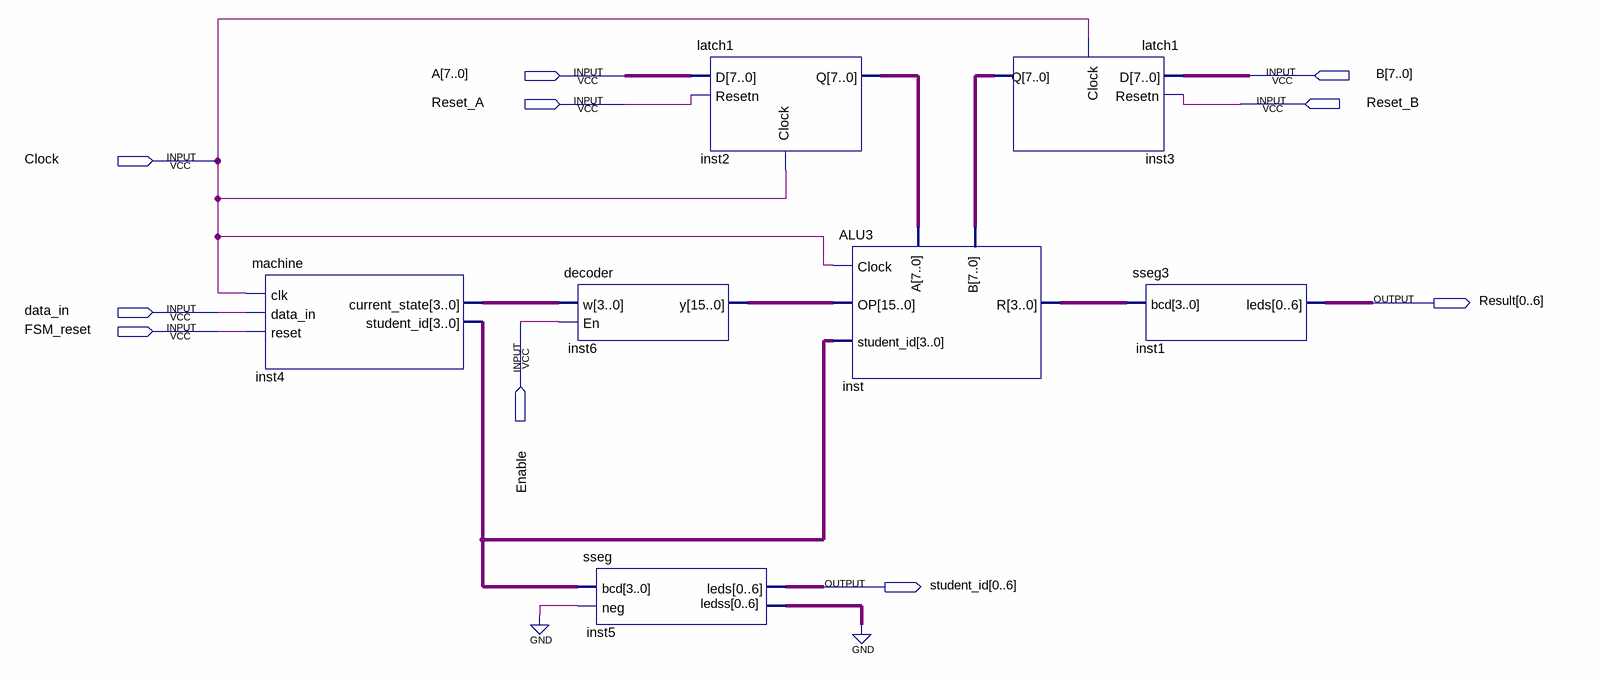
[diagram p0: schematic sheet]
// Quartus schematic problem3.bdf as structural Verilog: 7 symbols, 10 pins
module problem3 (
  input  [7:0] A,
  input  [7:0] B,
  input  Reset_A,
  input  Reset_B,
  input  Clock,
  input  data_in,
  input  Enable,
  input  FSM_reset,
  output [0:6] Result,
  output [0:6] student_id
);

  wire [3:0] inst4_current_state, inst4_student_id, inst_r;
  wire [6:0] inst5_ledss;
  wire [7:0] inst2_q, inst3_q;
  wire [15:0] inst6_y;

  machine inst4 (
    .clk(Clock), .data_in(data_in), .reset(FSM_reset), .student_id(inst4_student_id),
    .current_state(inst4_current_state));
  decoder inst6 (.w(inst4_current_state), .En(Enable), .y(inst6_y));
  sseg inst5 (.bcd(inst4_student_id), .neg(1'b0), .leds(student_id), .ledss(inst5_ledss));
  latch1 inst2 (.D(A), .Resetn(Reset_A), .Clock(Clock), .Q(inst2_q));
  ALU3 inst (.Clock(Clock), .A(inst2_q), .B(inst3_q), .student_id(inst4_student_id), .OP(inst6_y), .R(inst_r));
  latch1 inst3 (.D(B), .Resetn(Reset_B), .Clock(Clock), .Q(inst3_q));
  sseg3 inst1 (.bcd(inst_r), .leds(Result));
  // also tied to GND on the sheet: {inst5_ledss[0], inst5_ledss[1], inst5_ledss[2], inst5_ledss[3], inst5_ledss[4], inst5_ledss[5], inst5_ledss[6]}
endmodule
